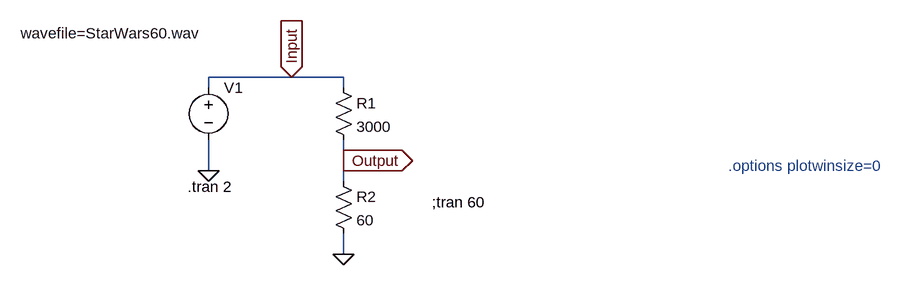
[diagram p0: schematic wavefileimport.asc]
wavefileimport.asc, the LTspice schematic file:
Version 4
SHEET 1 1180 680
WIRE 240 112 112 112
WIRE 320 112 240 112
WIRE 112 128 112 112
WIRE 320 128 320 112
WIRE 320 240 320 208
WIRE 112 256 112 208
WIRE 320 272 320 240
WIRE 320 384 320 352
FLAG 320 384 0
FLAG 112 256 0
FLAG 320 240 Output
IOPIN 320 240 Out
FLAG 240 112 Input
IOPIN 240 112 In
SYMBOL voltage 112 112 R0
WINDOW 3 -289 -68 Left 2
SYMATTR Value wavefile=StarWars60.wav
SYMATTR InstName V1
SYMBOL res 304 112 R0
SYMATTR InstName R1
SYMATTR Value 3000
SYMBOL res 304 256 R0
SYMATTR InstName R2
SYMATTR Value 60
TEXT 80 280 Left 2 !.tran 2
TEXT 456 304 Left 2 !;tran 60
TEXT 912 248 Left 2 ;.options plotwinsize=0

The netlist it stands for:
* wavefileimport.asc
V1 Input 0 wavefile=StarWars60.wav
R1 Input Output 3000
R2 Output 0 60
.tran 2
;tran 60
* .options plotwinsize=0
.backanno
.end